# Altium schematic sheet Accumulator TS Circuits.SchDoc
size A3; SheetNumber: 2; SheetTotal: 2
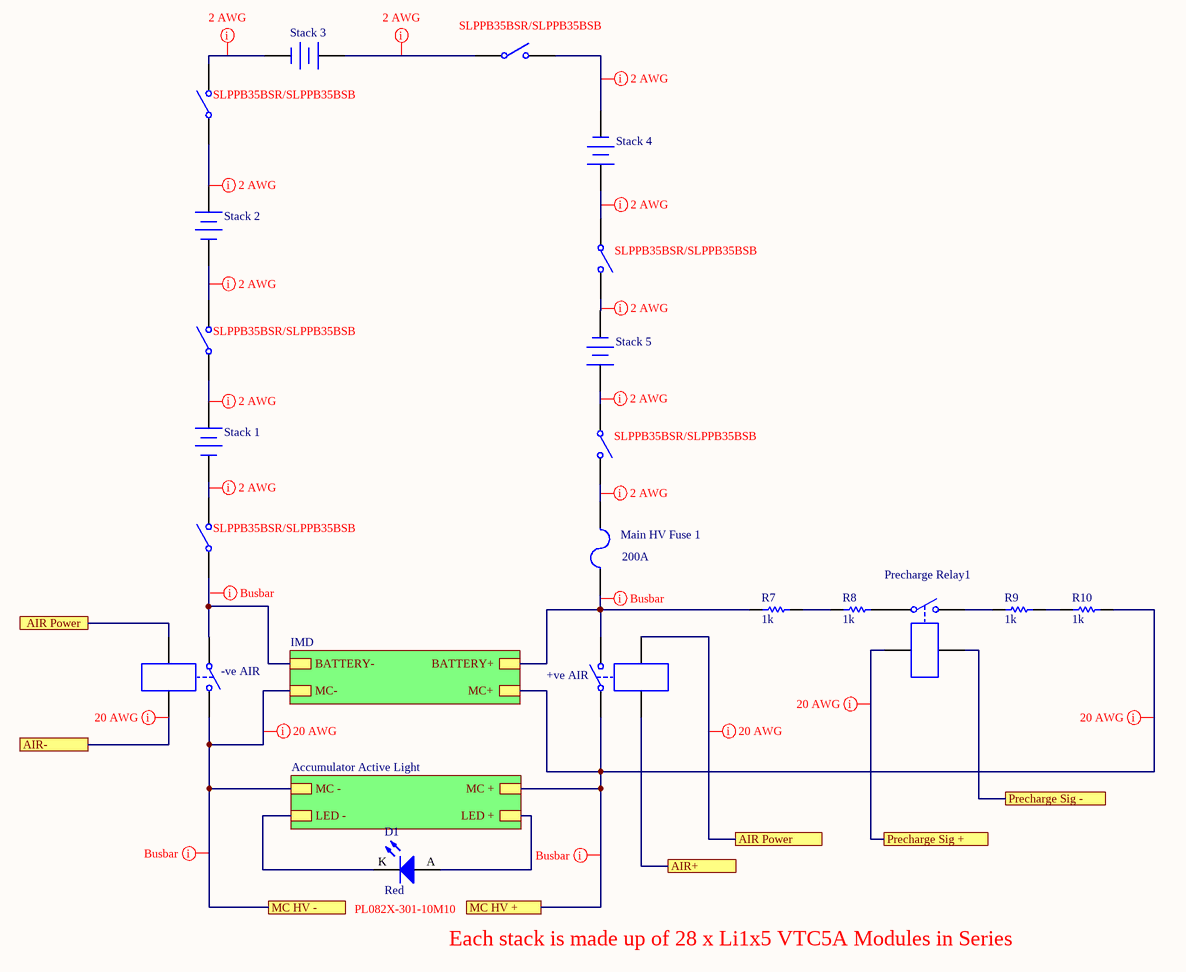
[diagram p0: Accumulator TS Circuits.SchDoc]

## Parts
(Parts that share a designator on the sheet are numbered #1, #2 ... from top to bottom, then left to right.)
+ve_AIR  (no value)  [MODULE4]
-ve_AIR  (no value)  [MODULE4]
D1  Red  [0805 LED]
Main_HV_Fuse_1  200A  [PIN-W2/E2.8]
Precharge_Relay1  (no value)  [MODULE4]
R7  value 1k  [AXIAL-0.3]
R8  value 1k  [AXIAL-0.3]
R9  value 1k  [AXIAL-0.3]
R10  value 1k  [AXIAL-0.3]
SLPPB35BSR/SLPPB35BSB#1  (no value)  [SPST-2]
SLPPB35BSR/SLPPB35BSB#2  (no value)  [SPST-2]
SLPPB35BSR/SLPPB35BSB#3  (no value)  [SPST-2]
SLPPB35BSR/SLPPB35BSB#4  (no value)  [SPST-2]
SLPPB35BSR/SLPPB35BSB#5  (no value)  [SPST-2]
SLPPB35BSR/SLPPB35BSB#6  (no value)  [SPST-2]
Stack_1  (no value)  [BAT-2]
Stack_2  (no value)  [BAT-2]
Stack_3  (no value)  [BAT-2]
Stack_4  (no value)  [BAT-2]
Stack_5  (no value)  [BAT-2]

## Sub-sheets
Accumulator Active Light = File Name: MC +, LED +, MC -, LED -
IMD = File Name: BATTERY+, MC+, BATTERY-, MC-

## Ports
AIR Power, AIR+, AIR-, MC HV +, MC HV -, Precharge Sig +, Precharge Sig -

## Nets
AIR Power: +ve_AIR.4 -ve_AIR.3 ; port AIR Power
AIR+: +ve_AIR.3 ; port AIR+
AIR-: -ve_AIR.4 ; port AIR-
MC HV +: +ve_AIR.1 R10.2 ; port MC HV +, sheet IMD/MC+, sheet Accumulator Active Light/MC +
MC HV -: -ve_AIR.2 ; port MC HV -, sheet IMD/MC-, sheet Accumulator Active Light/MC -
Precharge Sig +: Precharge_Relay1.3 ; port Precharge Sig +
Precharge Sig -: Precharge_Relay1.4 ; port Precharge Sig -
Net+ve_AIR_2: +ve_AIR.2 Main_HV_Fuse_1.2 R7.1 ; sheet IMD/BATTERY+
Net-ve_AIR_1: -ve_AIR.1 SLPPB35BSR/SLPPB35BSB#6.1(COMMON) ; sheet IMD/BATTERY-
NetD1_A: D1.A ; sheet Accumulator Active Light/LED +
NetD1_K: D1.K ; sheet Accumulator Active Light/LED -
NetMain_HV_Fuse_1_1: Main_HV_Fuse_1.1 SLPPB35BSR/SLPPB35BSB#5.2(NO)
NetPrecharge_Relay1_1: Precharge_Relay1.1 R8.2
NetPrecharge_Relay1_2: Precharge_Relay1.2 R9.1
NetR7_2: R7.2 R8.1
NetR9_2: R9.2 R10.1
NetSLPPB35BSR/SLPPB35BSB#1_1: SLPPB35BSR/SLPPB35BSB#1.1(COMMON) Stack_3.1(+)
NetSLPPB35BSR/SLPPB35BSB#1_2: SLPPB35BSR/SLPPB35BSB#1.2(NO) Stack_4.2(-)
NetSLPPB35BSR/SLPPB35BSB#2_1: SLPPB35BSR/SLPPB35BSB#2.1(COMMON) Stack_2.1(+)
NetSLPPB35BSR/SLPPB35BSB#2_2: SLPPB35BSR/SLPPB35BSB#2.2(NO) Stack_3.2(-)
NetSLPPB35BSR/SLPPB35BSB#3_1: SLPPB35BSR/SLPPB35BSB#3.1(COMMON) Stack_4.1(+)
NetSLPPB35BSR/SLPPB35BSB#3_2: SLPPB35BSR/SLPPB35BSB#3.2(NO) Stack_5.2(-)
NetSLPPB35BSR/SLPPB35BSB#4_1: SLPPB35BSR/SLPPB35BSB#4.1(COMMON) Stack_1.1(+)
NetSLPPB35BSR/SLPPB35BSB#4_2: SLPPB35BSR/SLPPB35BSB#4.2(NO) Stack_2.2(-)
NetSLPPB35BSR/SLPPB35BSB#5_1: SLPPB35BSR/SLPPB35BSB#5.1(COMMON) Stack_5.1(+)
NetSLPPB35BSR/SLPPB35BSB#6_2: SLPPB35BSR/SLPPB35BSB#6.2(NO) Stack_1.2(-)

## Layout directives
mark named 2 AWG: NetMain_HV_Fuse_1_1, NetSLPPB35BSR/SLPPB35BSB#1_1, NetSLPPB35BSR/SLPPB35BSB#1_2, NetSLPPB35BSR/SLPPB35BSB#2_1, NetSLPPB35BSR/SLPPB35BSB#2_2, NetSLPPB35BSR/SLPPB35BSB#3_1, NetSLPPB35BSR/SLPPB35BSB#3_2, NetSLPPB35BSR/SLPPB35BSB#4_1, NetSLPPB35BSR/SLPPB35BSB#4_2, NetSLPPB35BSR/SLPPB35BSB#5_1, NetSLPPB35BSR/SLPPB35BSB#6_2
mark named Busbar: (no net found under the mark), MC HV +, MC HV -, Net+ve_AIR_2
mark named 20 AWG: AIR Power, AIR-, MC HV +, MC HV -, Precharge Sig +

## Notes on the sheet
- (near D1) PL082X-301-10M10
- Each stack is made up of 28 x Li1x5 VTC5A Modules in Series

## Library data of the parts
+ve_AIR -ve_AIR Precharge_Relay1 = Relay-SPST: Single-Pole Single-Throw Relay; Published: 24-Mar-1999; LatestRevisionDate: 17-Jul-2002; LatestRevisionNote: Re-released for DXP Platform.; PackageReference: MODULE4; Publisher: Altium Limited
D1 = SML-210LTT86: Red LED Indication - Discrete 1.75V 0805 (2012 Metric); Manufacturer: ROHM Semiconductor; Part Number: SML-210LTT86; Colour: Red; Digikey Part Number: 511-1286-1-ND
Main_HV_Fuse_1 = Fuse 2: Fuse; Published: 8-Jun-2000; LatestRevisionDate: 17-Jul-2002; LatestRevisionNote: Re-released for DXP Platform.; PackageReference: PIN-W2/E2.8; Publisher: Altium Limited; PackageDescription: Thru-Hole; 2 Leads
R7-R10 = Res1: Resistor; Published: 8-Jun-2000; LatestRevisionDate: 17-Jul-2002; LatestRevisionNote: Re-released for DXP Platform.; PackageReference: AXIAL-0.3; Publisher: Altium Limited; PackageDescription: Axial Device, Thru-Hole; 2 Leads; 0.3 in Pin Spacing
SLPPB35BSR/SLPPB35BSB#1-SLPPB35BSR/SLPPB35BSB#6 = SW-SPST: Single-Pole, Single-Throw Switch; Published: 24-Mar-1999; LatestRevisionDate: 17-Jul-2002; LatestRevisionNote: Re-released for DXP Platform.; PackageReference: SPST-2; Publisher: Altium Limited; PackageDescription: Switch; 2 Leads
Stack_1-Stack_5 = Battery: Multicell Battery; Published: 24-Mar-1999; LatestRevisionDate: 17-Jul-2002; LatestRevisionNote: Re-released for DXP Platform.; PackageReference: BAT-2; Publisher: Altium Limited; PackageDescription: Battery; 2 Leads